# EAGLE design display (EAGLE 6.6.0)
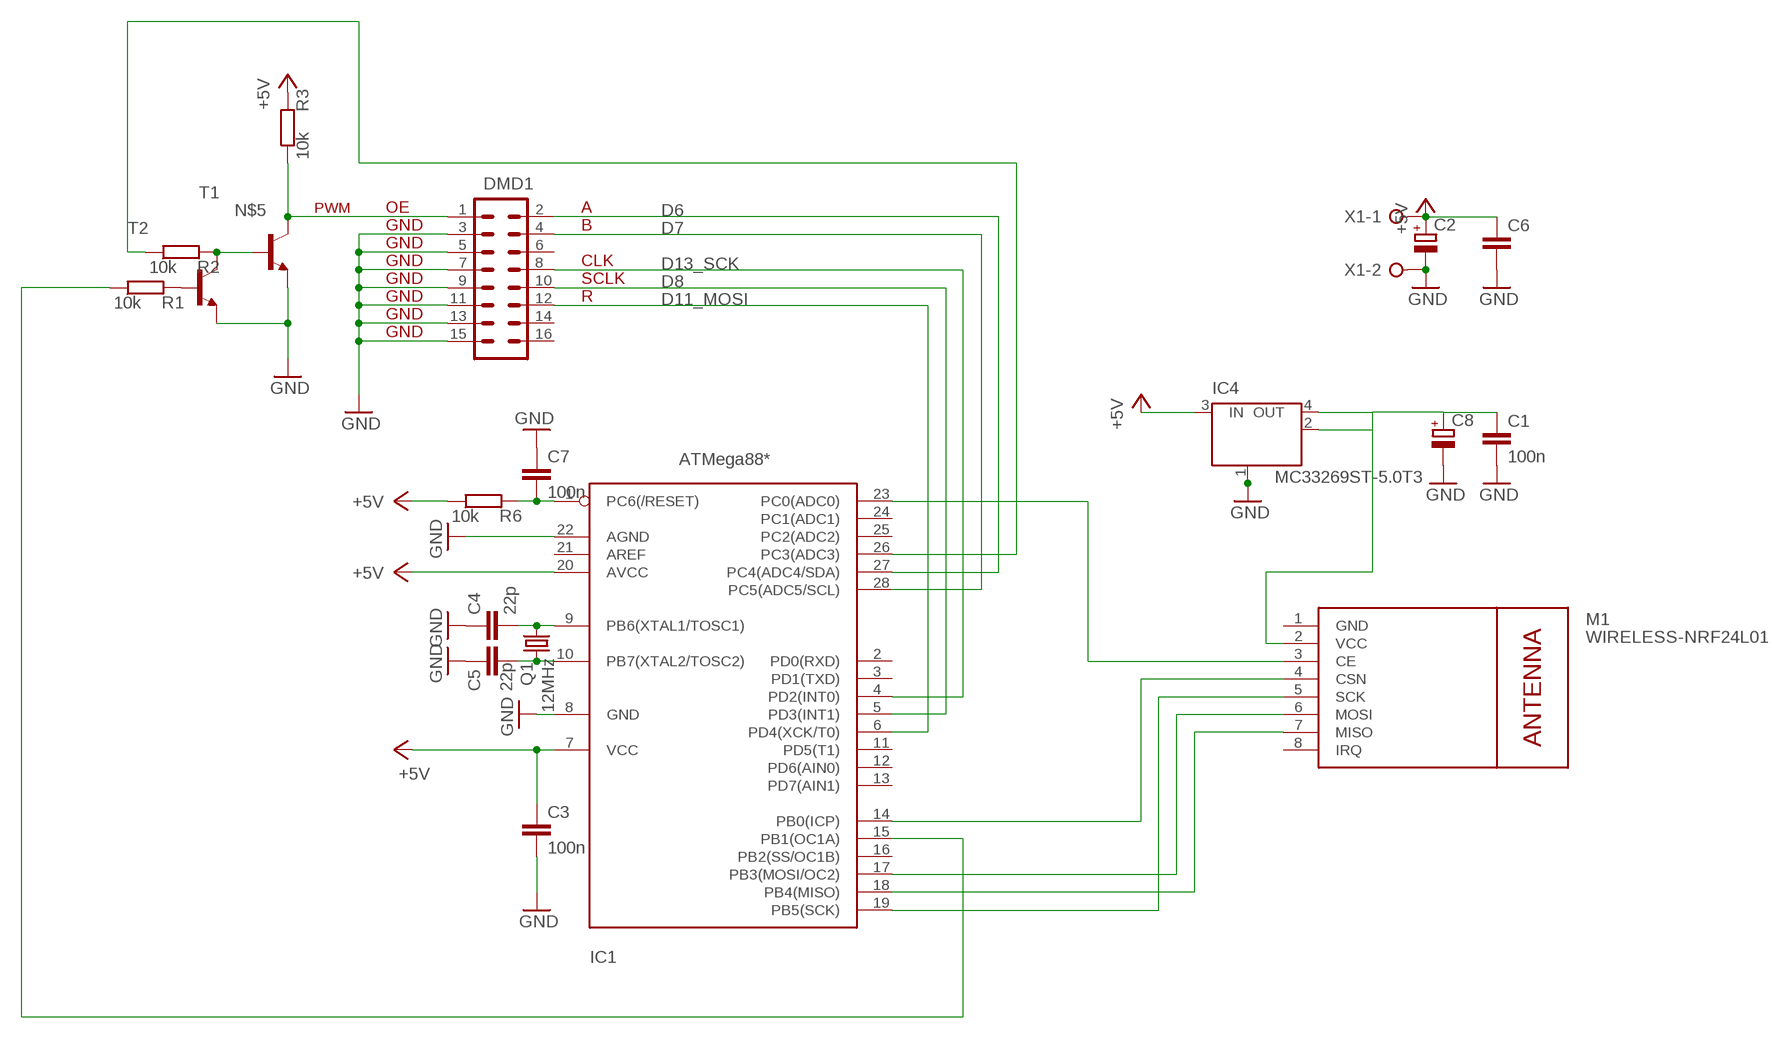
[diagram p0: schematic, sheet 1]

## Parts
C1  100n  C-EU025-024X044  [C025-024X044]
C2  CPOL-EUE2.5-6  [E2,5-6]
C3  100n  C-EU025-024X044  [C025-024X044]
C4  22p  C-EU025-024X044  [C025-024X044]
C5  22p  C-EU025-024X044  [C025-024X044]
C6  C-EU075-042X103  [C075-042X103]
C7  100n  C-EU025-024X044  [C025-024X044]
C8  CPOL-EUE2.5-6  [E2,5-6]
DMD1  M08X2  M08X2SMALLERPADS  [2X8-SMALLERPADS]
IC1  ATMega88*  MEGA8-P  [DIL28-3]
IC4  MC33269ST-5.0T3  MC33269ST-3.3T3  [SOT223]
M1  WIRELESS-NRF24L01  [WIRELESS-NRF24L01]
Q1  12MHz  CRYTALHC49S  [HC49/S]
R1  10k  R-EU_0207/10  [0207/10]
R2  10k  R-EU_0207/10  [0207/10]
R3  10k  R-EU_0207/10  [0207/10]
R6  10k  R-EU_0207/10  [0207/10]
T1  BC548-NPN-TO92-CBE  [TO92-CBE]
T2  BC548-NPN-TO92-CBE  [TO92-CBE]
X1  W237-02P  [W237-132]

## Nets
+5V: C2.+ C3.1 C6.1 IC1.7(VCC) IC1.20(AVCC) IC4.3(IN) R3.2 R6.1 X1.1
+5V1: C1.1 C8.+ IC4.2(OUT) IC4.4(OUT) M1.2(VCC)
D6: DMD1.2 IC1.27(PC4(ADC4/SDA))
D7: DMD1.4 IC1.28(PC5(ADC5/SCL))
D8: DMD1.10 IC1.5(PD3(INT1))
D9: IC1.26(PC3(ADC3)) R2.1
D11_MOSI: DMD1.12 IC1.6(PD4(XCK/T0))
D13_SCK: DMD1.8 IC1.4(PD2(INT0))
GND: C1.2 C2.- C3.2 C4.1 C5.1 C6.2 C7.1 C8.- DMD1.3 DMD1.5 DMD1.7 DMD1.9 DMD1.11 DMD1.13 DMD1.15 IC1.8(GND) IC1.22(AGND) IC4.1(GND/ADJ) T1.E T2.E X1.2
N$1: C7.2 IC1.1(PC6(/RESET)) R6.2
N$2: R2.2 T1.B T2.C
N$3: R1.2 T2.B
N$4: IC1.15(PB1(OC1A)) R1.1
N$5: DMD1.1 R3.1 T1.C
N$6: IC1.17(PB3(MOSI/OC2)) M1.6(MOSI)
N$9: IC1.18(PB4(MISO)) M1.7(MISO)
N$10: IC1.19(PB5(SCK)) M1.5(SCK)
N$11: IC1.23(PC0(ADC0)) M1.3(CE)
N$12: IC1.14(PB0(ICP)) M1.4(CSN)
N$22: C4.2 IC1.9(PB6(XTAL1/TOSC1)) Q1.2
N$23: C5.2 IC1.10(PB7(XTAL2/TOSC2)) Q1.1
Unconnected: DMD1.6 DMD1.14 DMD1.16 IC1.2(PD0(RXD)) IC1.3(PD1(TXD)) IC1.11(PD5(T1)) IC1.12(PD6(AIN0)) IC1.13(PD7(AIN1)) IC1.16(PB2(SS/OC1B)) IC1.21(AREF) IC1.24(PC1(ADC1)) IC1.25(PC2(ADC2)) M1.8(IRQ)

## Notes on the sheet
- PWM | OE | A
- GND | B
- GND
- GND | CLK
- GND | SCLK
- GND | R
- GND
- GND

## Power pins joined to a net without a drawn wire
GND: M1.1(GND)

## Library data of the parts
C1 C3-C7 = rcl:C-EU: CAPACITOR, European symbol
C2 C8 = rcl:CPOL-EU: POLARIZED CAPACITOR, European symbol
DMD1 = freetronics-master-v1:M08X2
IC1 = atmel:MEGA8-P: MICROCONTROLLER 8 Kbytes FLASH 1 kbytes SRAM 512 bytes EEPROM USART 4-channel 10 bit ADC 2-channel 8 bit ADC Source: avr.lbr
IC4 = linear:MC33269ST*: Adjustable Output Low Dropout Voltage Regulator 800 mA Source: http://www.onsemi.com/pub/Collateral/MC33269-D.PDF
M1 = diy-modules:WIRELESS-NRF24L01: 2.4 GHz Wireless Module based on NRF24L01 chip More details available here: http://www.electrodragon.com/w/NRF24L01 Click here to find device on ebay.com <http://www.ebay.com/sch/nrf24l01+arduino>
Q1 = crystal:CRYTAL: CRYSTAL
R1-R3 R6 = rcl:R-EU_: RESISTOR, European symbol
T1 T2 = transistor:*-NPN-: NPN Transistror BF959 corrected 2008.03.06
X1 = con-wago-508:W237-02P: WAGO SREW CLAMP; OC_FARNELL: unknown; OC_NEWARK: unknown

## Board
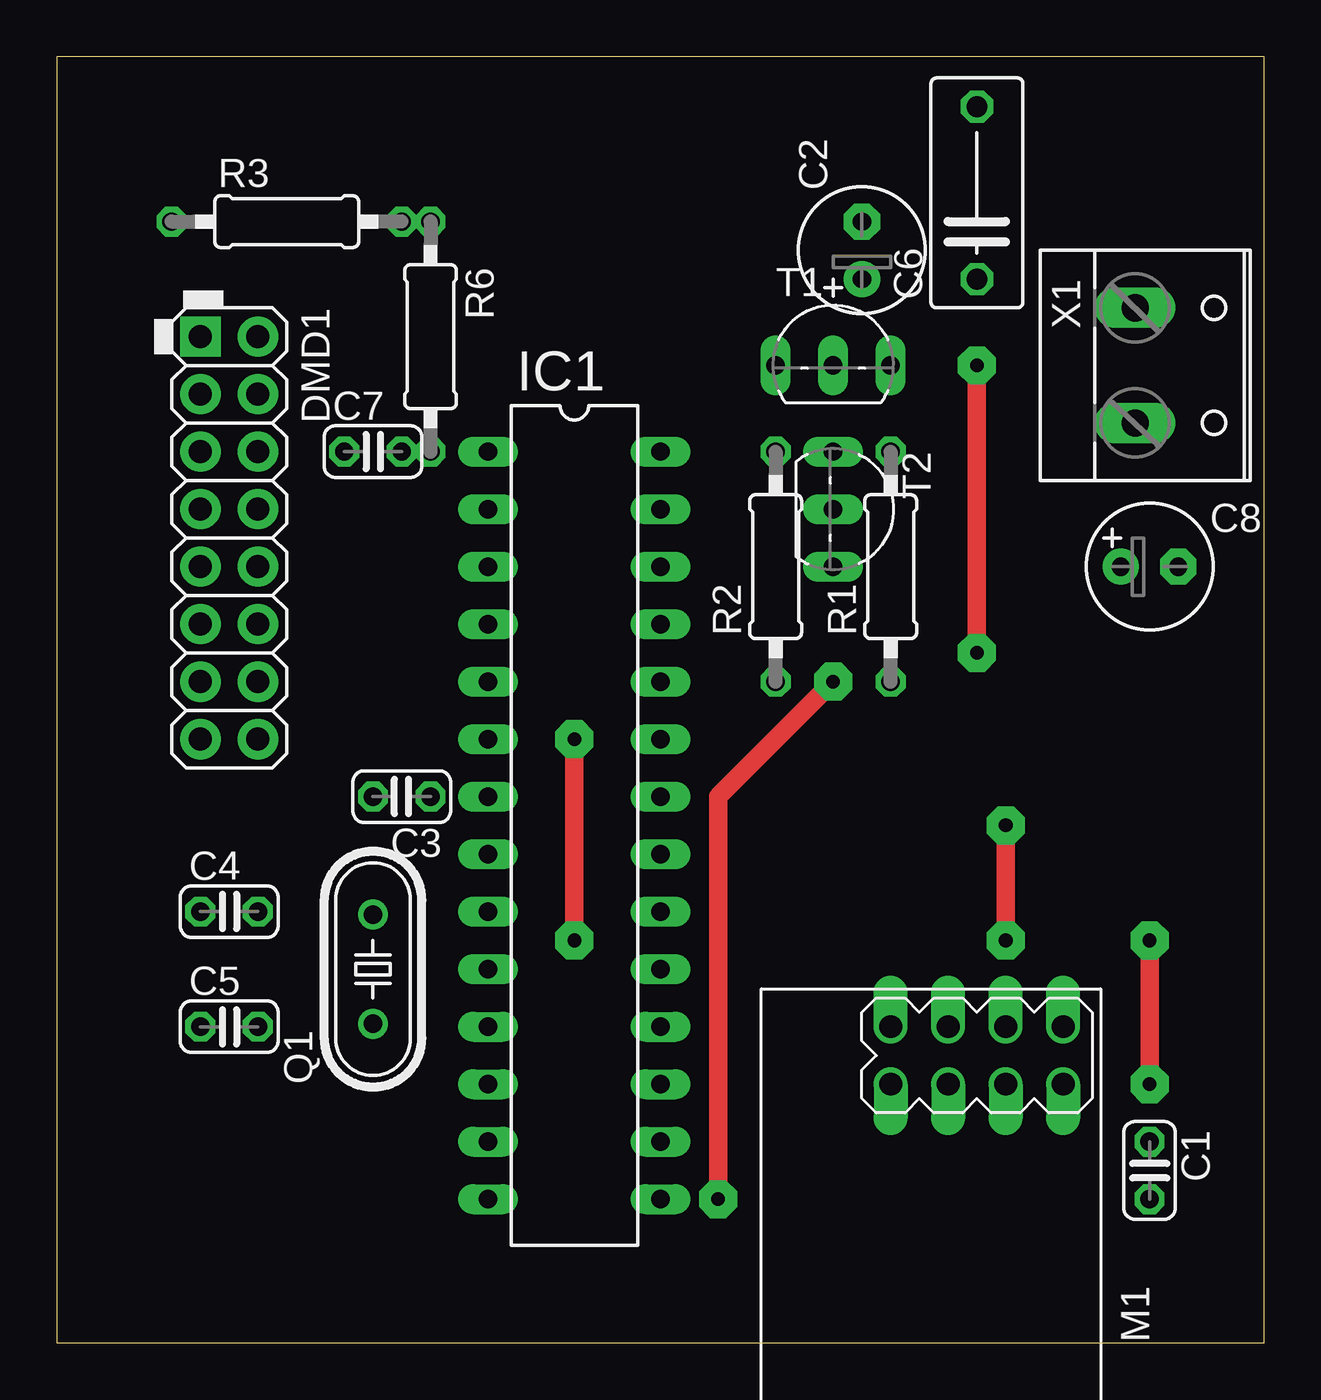
[diagram p1: board, top side]
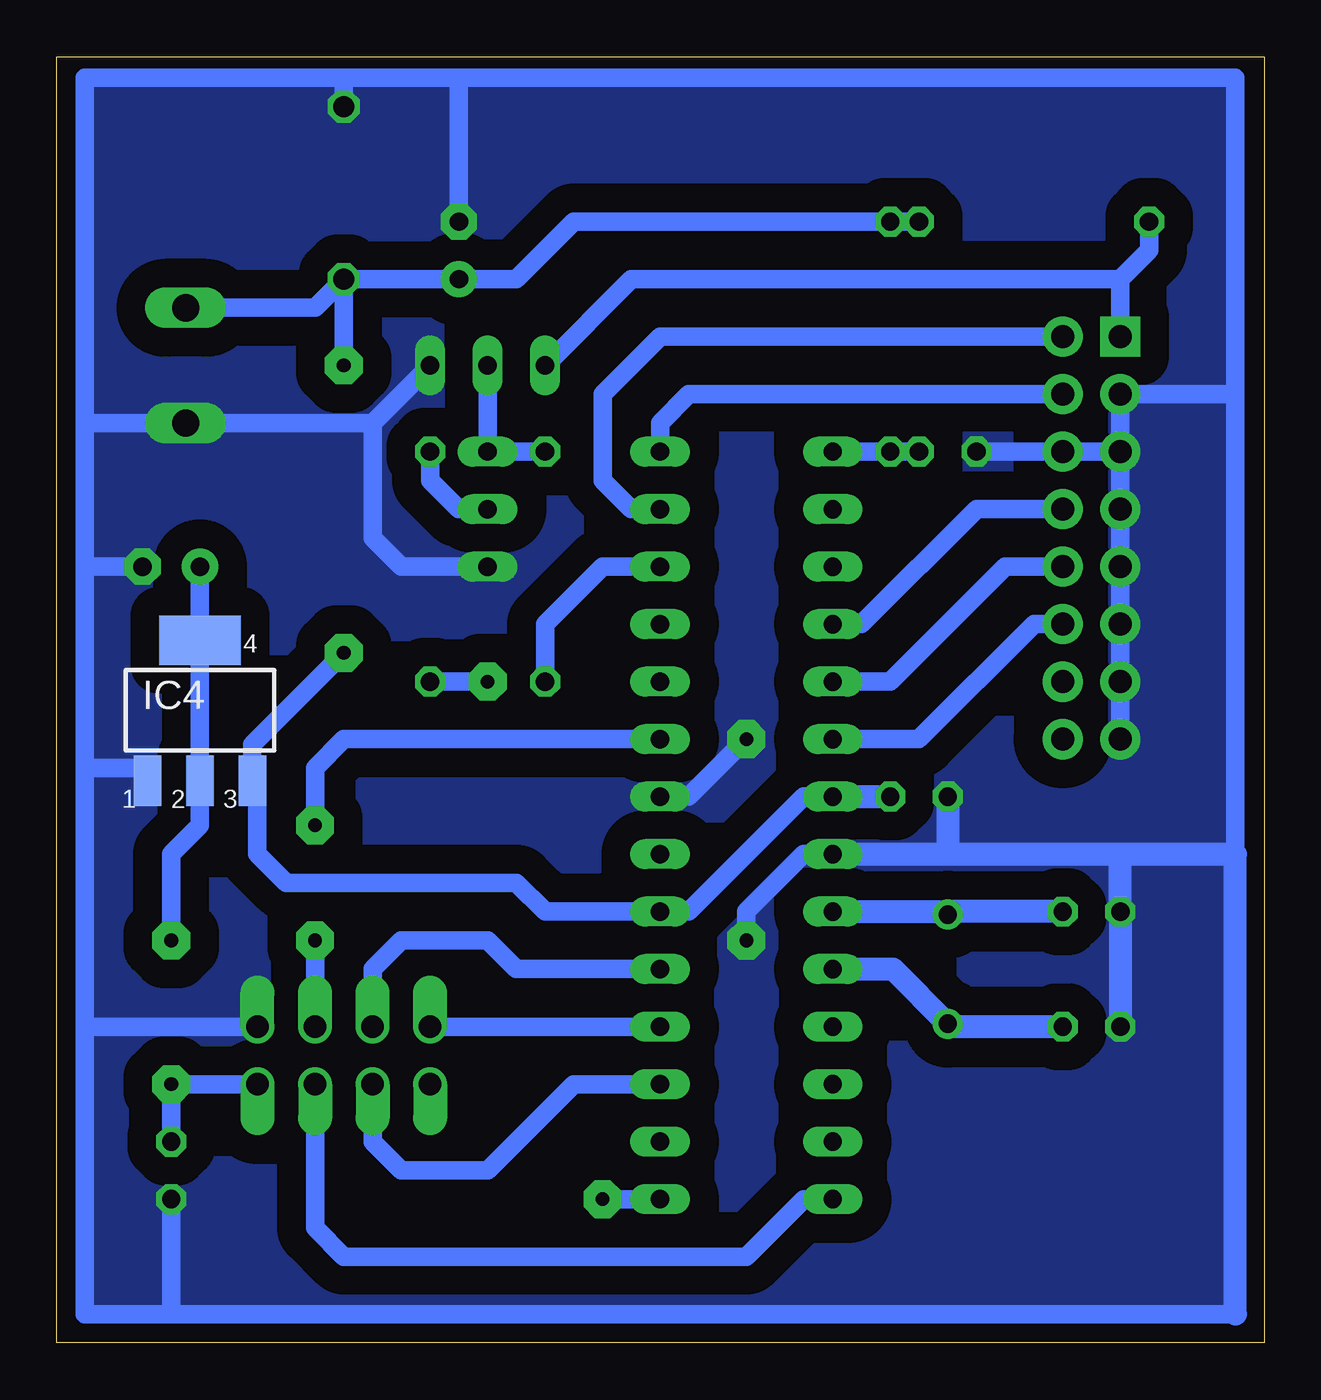
[diagram p2: board, bottom side, seen from below]

Size 53.32 x 56.82 mm. Coordinates in mm from the lower left corner, seen from the top.
Outline: 0,0 53.32,0 53.32,56.82 0,56.82 0,0
Copper layers (1*16): Top 0.035mm / dielectric 1.5mm / Bottom 0.035mm
Design rules "default": minimum track width 10mil, minimum drill 24mil, track to track 8mil, track to pad 8mil, pad to pad 8mil, via to via 8mil, smd to smd 8mil, copper to edge 40mil, drill to drill 8mil, minimum pad ring 10mil, minimum via ring 8mil, stop-mask expansion 4mil, vias tented up to drill 0mil, thermal gap 10mil

### Footprints (pad centres in the part's own frame; a part is rotated, then mirrored left to right if it is on the bottom)
C025-024X044 = drill 0.813 octagon: 1 -1.27,0; 2 1.27,0
E2,5-6 = drill 0.813 pad 1.6: + -1.27,0 | drill 0.813 pad 1.6 octagon: - 1.27,0
C075-042X103 = drill 0.914 octagon: 1 -3.81,0; 2 3.81,0
2X8-SMALLERPADS = drill 1.016 pad 1.778 square: 1 0,0 | drill 1.016 pad 1.778: 2 0,2.54; 3 2.54,0; 4 2.54,2.54; 5 5.08,0; 6 5.08,2.54; 7 7.62,0; 8 7.62,2.54; 9 10.16,0; 10 10.16,2.54; 11 12.7,0; 12 12.7,2.54; 13 15.24,0; 14 15.24,2.54; 15 17.78,0; 16 17.78,2.54
DIL28-3 = drill 0.813 long: 1 -16.51,-3.81; 2 -13.97,-3.81; 3 -11.43,-3.81; 4 -8.89,-3.81; 5 -6.35,-3.81; 6 -3.81,-3.81; 7 -1.27,-3.81; 8 1.27,-3.81; 9 3.81,-3.81; 10 6.35,-3.81; 11 8.89,-3.81; 12 11.43,-3.81; 13 13.97,-3.81; 14 16.51,-3.81; 15 16.51,3.81; 16 13.97,3.81; 17 11.43,3.81; 18 8.89,3.81; 19 6.35,3.81; 20 3.81,3.81; 21 1.27,3.81; 22 -1.27,3.81; 23 -3.81,3.81; 24 -6.35,3.81; 25 -8.89,3.81; 26 -11.43,3.81; 27 -13.97,3.81; 28 -16.51,3.81
SOT223 = smd 1.219 x 2.235: 1 -2.311,-3.099; 2 0,-3.099; 3 2.311,-3.099 | smd 3.6 x 2.2: 4 0,3.099
WIRELESS-NRF24L01 = drill 1 offset: 1 -12.7,6.35; 2 -10.16,6.35; 3 -12.7,3.81; 4 -10.16,3.81; 5 -12.7,1.27; 6 -10.16,1.27; 7 -12.7,-1.27; 8 -10.16,-1.27
HC49/S = drill 0.813: 1 -2.413,0; 2 2.413,0
0207/10 = drill 0.813 octagon: 1 -5.08,0; 2 5.08,0
TO92-CBE = drill 0.813 long: B 0,0; C -2.54,0; E 2.54,0
W237-132 = drill 1.194 long: 1 -2.54,-0.635; 2 2.54,-0.635

### Placement (x,y rotation side)
C1  48.26,7.62 270 top
C2  35.56,48.26 90 top
C3  15.24,24.13 180 top
C4  7.62,19.05 0 top
C5  7.62,13.97 0 top
C6  40.64,50.8 90 top
C7  13.97,39.37 0 top
C8  48.26,34.29 0 top
DMD1  6.35,44.45 270 top
IC1  22.86,22.86 270 top
IC4  46.99,27.94 0 bottom
M1  38.1,1.27 270 top
Q1  13.97,16.51 90 top
R1  36.83,34.29 90 top
R2  31.75,34.29 90 top
R3  10.16,49.53 0 top
R6  16.51,44.45 270 top
T1  34.29,43.18 0 top
T2  34.29,36.83 270 top
X1  48.26,43.18 270 top

### Tracks (layer width: path | path; a pad name or v marks a point on that pad's centre or on a via)
+5V  (via drill 0.6 pad 1.68)
  Top 0.813: v40.64,43.18 v40.64,30.48
  Bottom 0.813: IC1.7 20.32,24.13 25.4,19.05 IC1.20 31.75,19.05 33.02,20.32 43.18,20.32 44.45,21.59 44.45,24.61 IC4.3 44.68,26.44 v40.64,30.48 | R3.2 R6.1 30.48,49.53 33.02,46.99 C2.+ C6.1 | C6.1 v40.64,43.18 | X1.1 41.91,45.72 C6.1
  Bottom 1.016: IC1.7 C3.1
+5V1  (via drill 0.6 pad 1.68)
  Top 0.813: v48.26,11.43 v48.26,17.78
  Bottom 0.813: M1.2 v48.26,11.43 C1.1 | v48.26,17.78 48.26,21.59 46.99,22.86 IC4.2 IC4.4 C8.+
D6
  Bottom 0.813: DMD1.2 26.67,44.45 29.21,41.91 29.21,38.1 27.94,36.83 IC1.27
D7
  Bottom 0.813: DMD1.4 25.4,41.91 26.67,40.64 IC1.28
D8
  Bottom 0.813: IC1.5 16.51,29.21 11.43,34.29 DMD1.10
D9
  Bottom 0.813: IC1.26 29.21,34.29 31.75,31.75 R2.1
D11_MOSI
  Bottom 0.813: IC1.6 15.24,26.67 10.16,31.75 DMD1.12
D13_SCK
  Bottom 0.813: IC1.4 17.78,31.75 12.7,36.83 DMD1.8
GND  (via drill 0.6 pad 1.68)
  Top 0.813: v22.86,26.67 v22.86,17.78
  Bottom 0.813: 48.26,1.27 52.07,1.27 52.07,13.97 | 1.27,41.91 DMD1.3 DMD1.5 | 1.27,41.91 1.27,21.59 | DMD1.15 DMD1.13 DMD1.11 DMD1.9 DMD1.7 DMD1.5 | IC1.22 25.4,24.13 v22.86,26.67 | v22.86,17.78 22.86,19.05 20.32,21.59 IC1.8 | M1.1 52.07,13.97 | C1.2 48.26,1.27 | T1.E 39.37,40.64 | 39.37,40.64 39.37,35.56 38.1,34.29 T2.E | 52.07,40.64 X1.2 39.37,40.64 | 52.07,40.64 52.07,34.29 | C8.- 52.07,34.29 | 40.64,55.88 C6.2 | 35.56,55.88 1.27,55.88 1.27,41.91 | 40.64,55.88 35.56,55.88 | C2.- 35.56,55.88 | 40.64,55.88 52.07,55.88 52.07,40.64 | C7.1 DMD1.5 | 48.26,1.27 1.27,1.27 | 52.07,34.29 52.07,25.4 | 52.07,25.4 52.07,13.97 | IC4.1 49.3,25.17 49.53,25.4 52.07,25.4
  Bottom 1.016: IC1.8 13.97,21.59 | 13.97,21.59 6.35,21.59 | 6.35,21.59 1.27,21.59 1.27,1.27 | C3.2 13.97,21.59 | C5.1 C4.1 6.35,21.59
  pour Bottom (isolate 1.27, no thermals): 0,57.15 53.34,57.15 53.34,0 0,0
N$1
  Bottom 0.813: IC1.1 R6.2 C7.2
N$2
  Bottom 0.813: R2.2 T2.C T1.B
N$3
  Bottom 0.813: T2.B 35.56,36.83 36.83,38.1 R1.2
N$4  (via drill 0.6 pad 1.68)
  Top 0.813: v29.21,6.35 29.21,24.13 v34.29,29.21
  Bottom 0.813: IC1.15 v29.21,6.35 | v34.29,29.21 R1.1
N$5
  Bottom 0.813: 6.35,46.99 5.08,48.26 R3.1 | DMD1.1 6.35,46.99 | 6.35,46.99 27.94,46.99 T1.C
N$6
  Bottom 0.813: IC1.17 30.48,11.43 34.29,7.62 38.1,7.62 39.37,8.89 M1.6
N$9
  Bottom 0.813: IC1.18 M1.7
N$10
  Bottom 0.813: IC1.19 33.02,16.51 34.29,17.78 38.1,17.78 39.37,16.51 M1.5
N$11  (via drill 0.6 pad 1.68)
  Top 0.813: v41.91,17.78 v41.91,22.86
  Bottom 0.813: M1.3 v41.91,17.78 | v41.91,22.86 41.91,25.4 40.64,26.67 IC1.23
N$12
  Bottom 0.813: IC1.14 20.32,6.35 22.86,3.81 40.64,3.81 41.91,5.08 M1.4
N$22
  Bottom 1.016: IC1.9 13.97,19.05 | C4.2 13.97,19.05 | 13.97,19.05 Q1.2
N$23
  Bottom 1.016: C5.2 13.97,13.97 Q1.1 16.38,16.51 IC1.10